# Altium schematic sheet sonar_tx.SchDoc
size A4
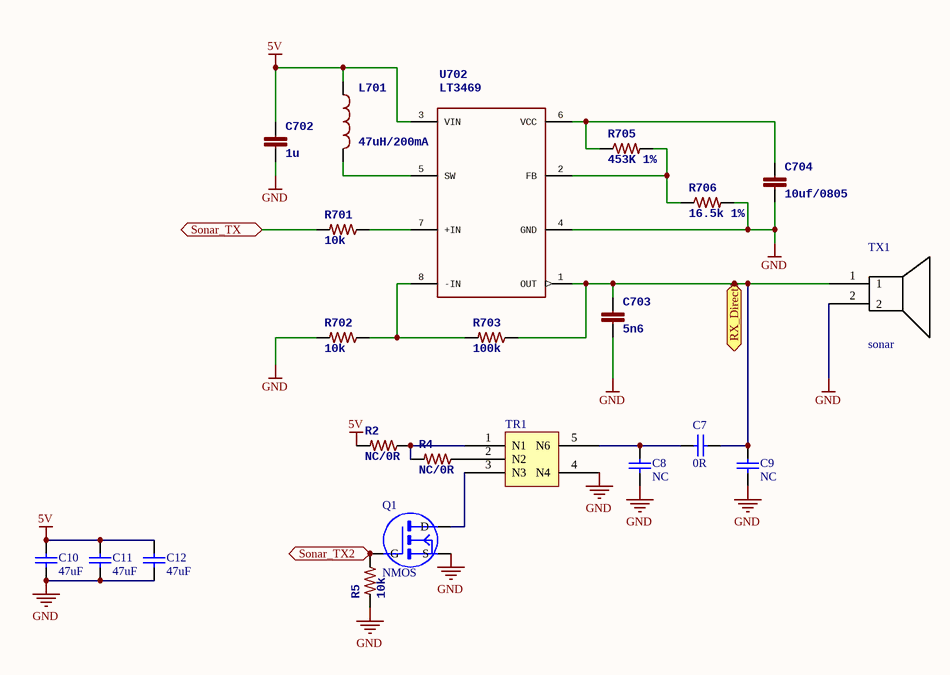
[diagram p0: sonar_tx.SchDoc]

## Parts
C7  value 0R  [0805]  (hidden comment: Cap)
C8  value NC  [0805]  (hidden comment: Cap)
C9  value NC  [0805]  (hidden comment: Cap)
C10  value 47uF  [0805]  (hidden comment: Cap)
C11  value 47uF  [0805]  (hidden comment: Cap)
C12  value 47uF  [0805]  (hidden comment: Cap)
C702  1u  [0402]
C703  5n6  [0402]
C704  10uf/0805  [0805]
L701  47uH/200mA  [0805-IND]
Q1  NMOS  [SOT23_L]
R2  NC/0R  [0402]
R4  NC/0R  [0402]
R5  10k  [0402]
R701  10k  [0402]
R702  10k  [0402]
R703  100k  [0402]
R705  453K 1%  [0402]
R706  16.5k 1%  [0402]
TR1  Transformer_B78416A2232A003  [Transformer_B78416A2232A003]  (value not drawn)
TX1  sonar  [sonar-16mm]
U702  LT3469  [SOT23-8]

## Ports
RX_Direct1, Sonar_TX, Sonar_TX2

## Nets
5V: C10.1 C11.1 C12.1 C702.1 L701.1 R2.2 U702.3(VIN)
GND: C8.2 C9.2 C10.2 C11.2 C12.2 C702.2 C703.2 C704.2 Q1.S R5.2 R702.2 R706.2 TR1.4(N4) TX1.2 U702.4(GND)
RX_Direct1: C7.1 C9.1 C703.1 R703.1 TX1.1 U702.1(OUT) ; port RX_Direct1
Sonar_TX: R701.2 ; port Sonar_TX
Sonar_TX2: Q1.G R5.1 ; port Sonar_TX2
NetC7_2: C7.2 C8.1 TR1.5(N6)
NetC704_1: C704.1 R705.1 U702.6(VCC)
NetL701_2: L701.2 U702.5(SW)
NetQ1_D: Q1.D TR1.3(N3)
NetR2_1: R2.1 R4.2 TR1.1(N1)
NetR4_1: R4.1 TR1.2(N2)
NetR701_1: R701.1 U702.7(+IN)
NetR702_1: R702.1 R703.2 U702.8(-IN)
NetR705_2: R705.2 R706.1 U702.2(FB)

## Library data of the parts
C7-C12 = Cap: Capacitor; Published: 8-Jun-2000; LatestRevisionDate: 17-Jul-2002; LatestRevisionNote: Re-released for DXP Platform.; PackageReference: RAD-0.3; Publisher: Altium Limited; PackageDescription: Radial Cap, Thru-Hole; 2 Leads; 0.3 in Pin Spacing
C702 = CAP0603: <b>Capacitor</b> / Standard 0603 ceramic capacitor, and 0.1" leaded capacitor.; PARTNO: CC0603ZRY5V7BB105
C703 = CAP0402: <b>Capacitor</b> / Standard 0603 ceramic capacitor, and 0.1" leaded capacitor.; PARTNO: C0402C562K5RACTU
C704 = CAP0402: <b>Capacitor</b> / Standard 0603 ceramic capacitor, and 0.1" leaded capacitor.; PARTNO: C1005X5R1C474K050BC
L701 = INDUCTOR0805: <b>Inductors</b> / Basic Inductor/Choke - 0603 and 1210. Footprints are not proven and vary greatly between part numbers. / SRR1210: Bourns SRR1210 parts, e.g. SRR1210-100M; PARTNO: MLZ2012M470W
Q1 = NMOS: pin to pad: D>1 G>3 S>2
R2 R4 R5 R701-R703 R705 R706 = RESISTOR0402-RES: <b>Resistor</b> / Basic schematic elements and footprints for 0603, 1206, and PTH 1/10th watt (small) resistors.; PARTNO: RMCF0402FT453K
U702 = LT3469: LT3469 Piezo microactuator driver with boost regulator; PARTNO: LT3469ETS8